# Altium schematic sheet ATmega324PB_Xplained_Pro_Target_MCU.SchDoc: Target MCU
size A3; Organization: ATMEL Norway; Address1: Vestre Rosten 79; Address2: N-7075 TILLER; Address3: NORWAY; DocumentNumber: A09-2589; Revision: 1; SheetNumber: 3; SheetTotal: 5; PageSetup: Record=PageOptions|CenterHorizontal=True|CenterVertical=True|PrintScale=1.01|XCorrection=1.00|YCorrection=1.00|PrintKind=1|BorderSize=5000000|LeftOffset=0|BottomOffset=0|Orientation=2|PaperLength=1000|PaperWidth=1000|Scale=100|PaperSource=7|PrintQuality=-4|MediaType=1|DitherType=10|PaperKind=A3 (297 x 420 mm)|PrintScaleMode=1
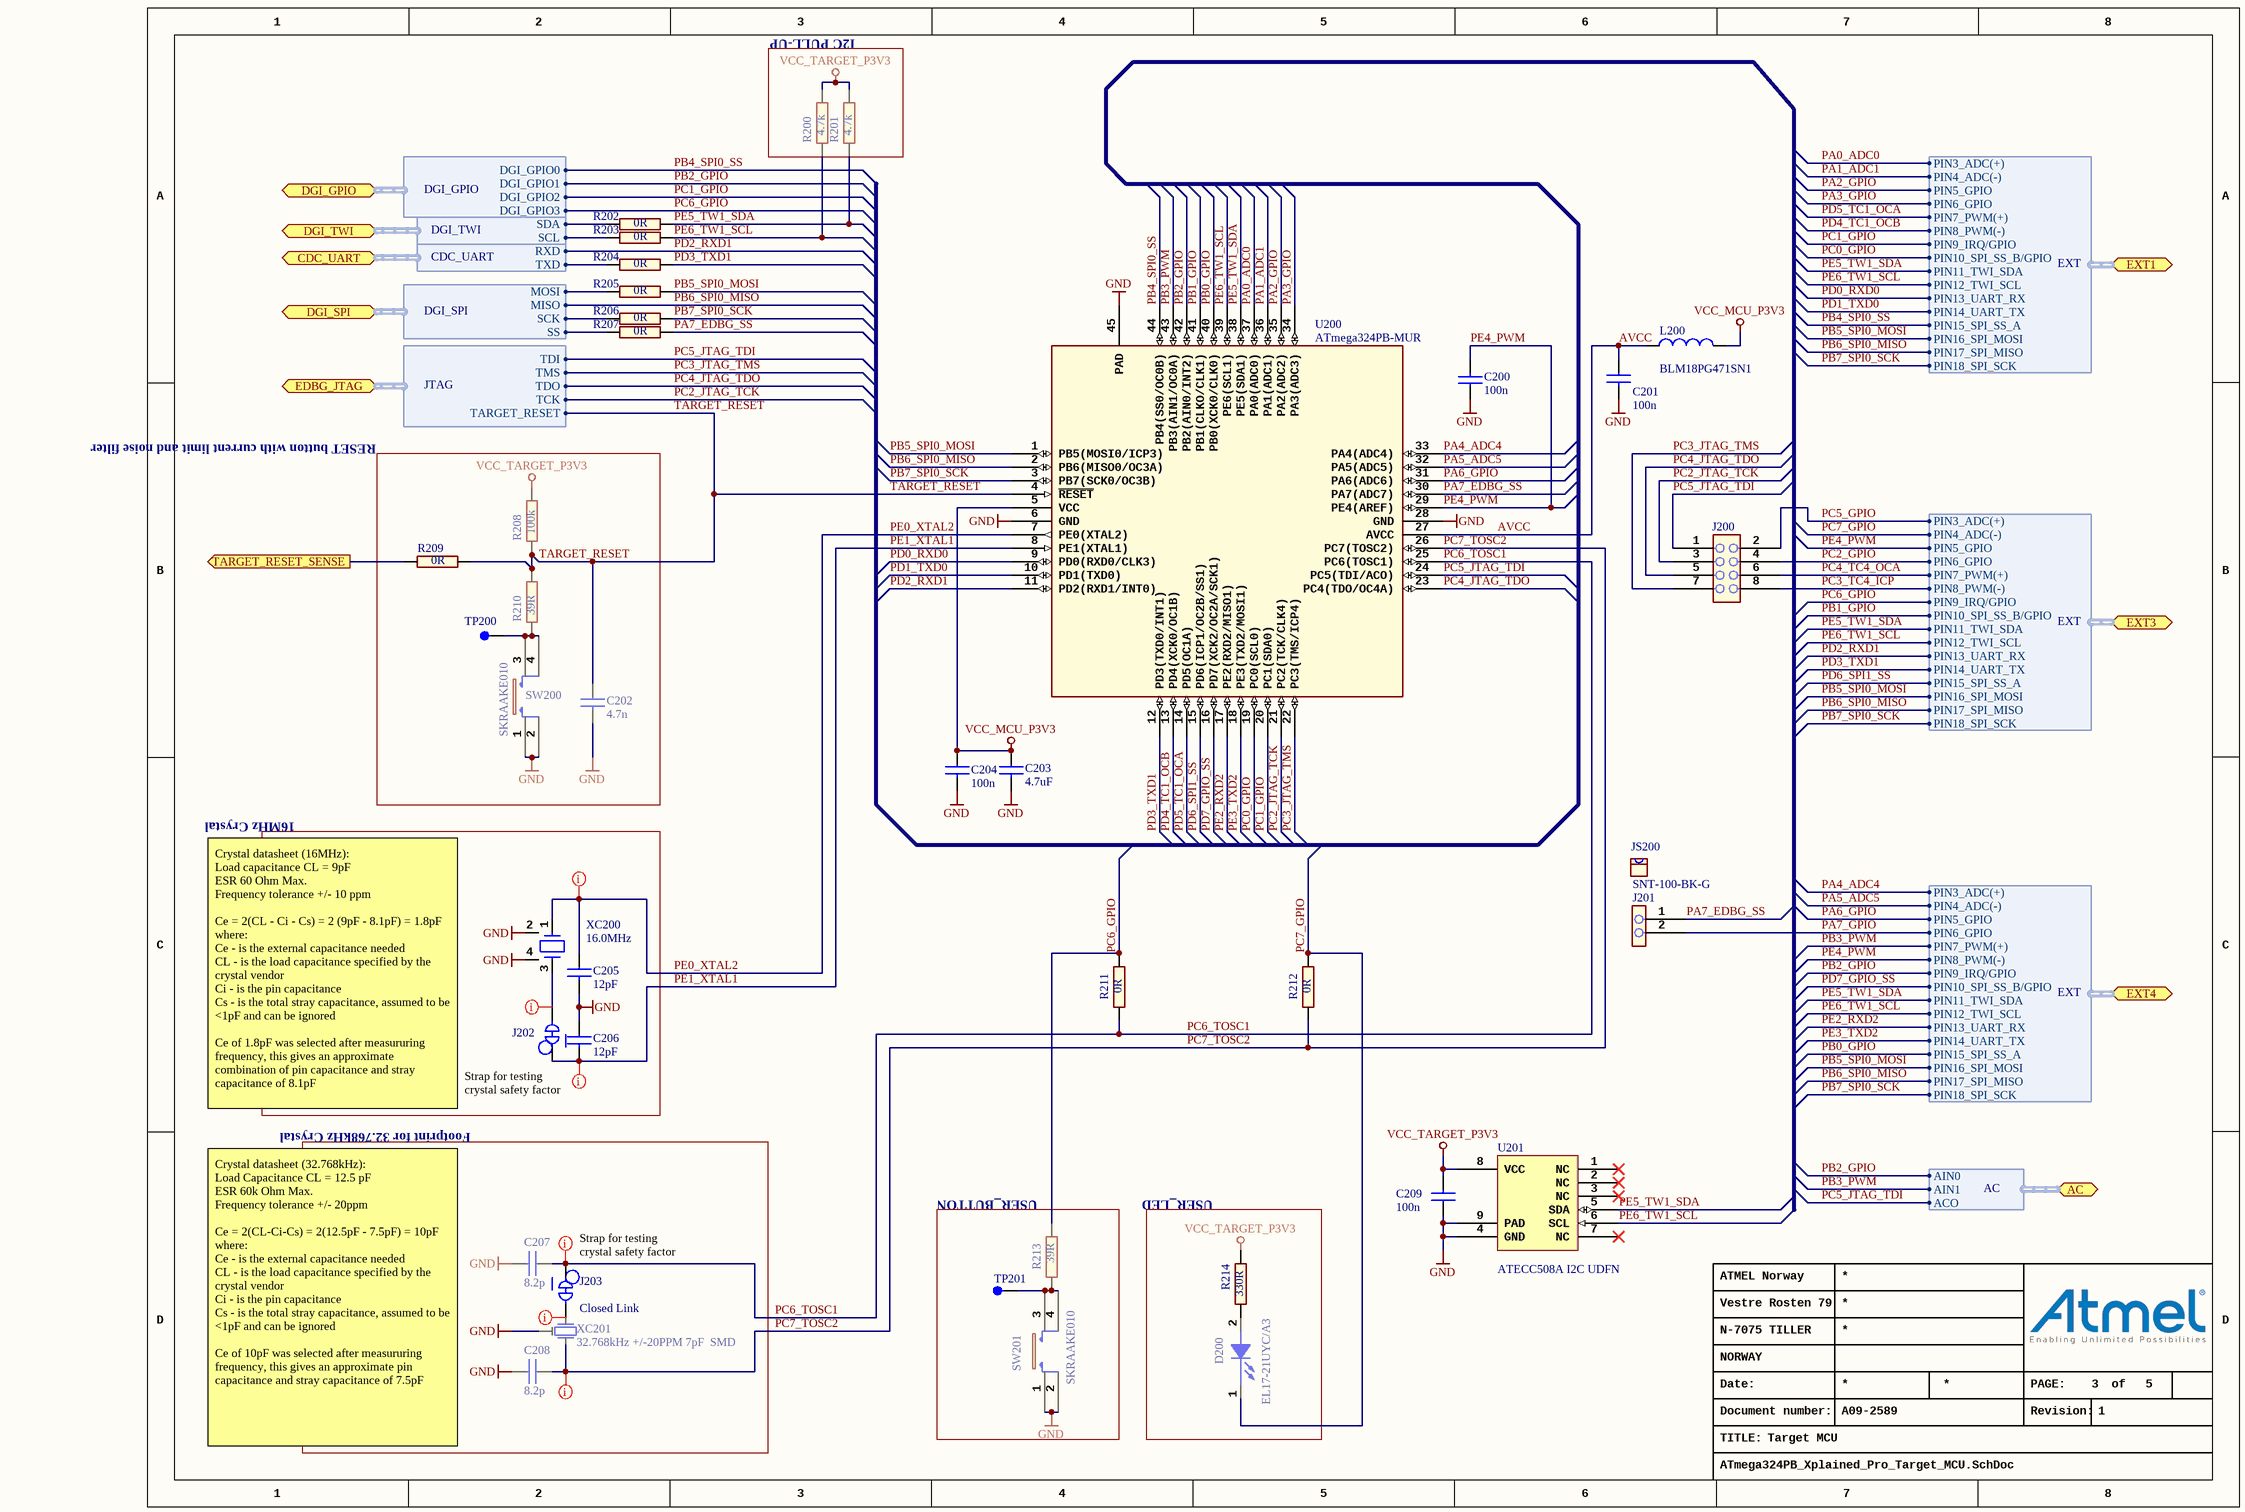
[diagram p0: ATmega324PB_Xplained_Pro_Target_MCU.SchDoc]

## Parts
C200  value 100n  [AP1-00001]
C201  value 100n  [AP1-00001]
C202  value 4.7n  [AP1-00053]
C203  value 4.7uF  [AP1-00039]
C204  value 100n  [AP1-00001]
C205  value 12pF  [AP1-00038]
C206  value 12pF  [AP1-00038]
C207  value 8.2p  [AP1-00001]
C208  value 8.2p  [AP1-00001]
C209  value 100n  [AP1-00001]
D200  value EL17-21UYC/A3  [AP4-00013]
J200  (no value)  [AP8-00971]
J201  (no value)  [AP8-00733]
J202  (no value)  [AP8-00595]  (net tie, no BOM)
J203  value Closed Link  [AP8-00595]  (net tie, no BOM)
JS200  value SNT-100-BK-G  [AP8-00525]
L200  value BLM18PG471SN1  [AP3-00005]
R200  value 4.7k  [AP2-00000]
R201  value 4.7k  [AP2-00000]
R202  value 0R  [AP2-00000]
R203  value 0R  [AP2-00000]
R204  value 0R  [AP2-00000]
R205  value 0R  [AP2-00000]
R206  value 0R  [AP2-00000]
R207  value 0R  [AP2-00000]
R208  value 100k  [AP2-00011]
R209  value 0R  [AP2-00000]
R210  value 39R  [AP2-00011]
R211  value 0R  [AP2-00000]
R212  value 0R  [AP2-00000]
R213  value 39R  [AP2-00011]
R214  value 330R  [AP2-00000]
SW200  value SKRAAKE010  [AP8-00137]  (hidden comment: Can be ordered in low volumes from Mouser)
SW201  value SKRAAKE010  [AP8-00137]  (hidden comment: Can be ordered in low volumes from Mouser)
TP200  (no value)  [AP8-00010]  (no BOM)
TP201  (no value)  [AP8-00010]  (no BOM)
U200  value ATmega324PB-MUR  [AP6-00147]  (hidden comment: Footprint has tight silkscreen to solder mask expansion clearance)
U201  value ATECC508A I2C UDFN  [AP6-00409]
XC200  value 16.0MHz  [AP7-00061]
XC201  value 32.768kHz +/-20PPM 7pF  SMD  [AP7-00044]  (hidden comment: Farnell order no:1539364)

## Blocks framed on the sheet
I2C PULL-UP: R200 R201
RESET button with current limit and noise filter: C202 R208-R210 SW200 TP200
16MHz Crystal: C205 C206 J202 XC200
Footprint for 32.768kHz Crystal: C207 C208 J203 XC201
USER_BUTTON: R213 SW201 TP201
USER_LED: D200 R214

## Ports
AC (harness AC), CDC_UART (harness CDC_UART), DGI_GPIO (harness DGI_GPIO), DGI_SPI (harness DGI_SPI), DGI_TWI (harness DGI_TWI), EDBG_JTAG (harness JTAG), EXT1 (harness EXT), EXT3 (harness EXT), EXT4 (harness EXT), TARGET_RESET_SENSE (out)

## Harnesses
DGI_GPIO: DGI_GPIO0, DGI_GPIO1, DGI_GPIO2, DGI_GPIO3
DGI_SPI: MISO, MOSI, SCK, SS
DGI_TWI: SCL, SDA
CDC_UART: RXD, TXD
EXT: PIN10_SPI_SS_B/GPIO, PIN11_TWI_SDA, PIN12_TWI_SCL, PIN13_UART_RX, PIN14_UART_TX, PIN15_SPI_SS_A, PIN16_SPI_MOSI, PIN17_SPI_MISO, PIN18_SPI_SCK, PIN3_ADC(+), PIN4_ADC(-), PIN5_GPIO, PIN6_GPIO, PIN7_PWM(+), PIN8_PWM(-), PIN9_IRQ/GPIO
JTAG: TCK, TDI, TDO, TMS, TARGET_RESET
AC: AIN1, AIN0, ACO

## Nets
GND: C200.1 C201.2 C202.2 C203.2 C204.2 C205.2 C206.1 C207.2 C208.2 C209.1 SW200.1 SW200.2 SW201.1 SW201.2 U200.6(GND) U200.28(GND) U200.45(PAD) U201.4(GND) U201.9(PAD) XC200.2(GND) XC200.4(GND) XC201.3
VCC_MCU_P3V3: C203.1 C204.1 L200.2 U200.5(VCC)
VCC_TARGET_P3V3: C209.2 R200.2 R201.2 R208.2 R214.2 U201.8(VCC)
AVCC: C201.1 L200.1 U200.27(AVCC)
PA0_ADC0: U200.37(PA0(ADC0)) ; port EXT1.PIN3_ADC(+)
PA1_ADC1: U200.36(PA1(ADC1)) ; port EXT1.PIN4_ADC(-)
PA2_GPIO: U200.35(PA2(ADC2)) ; port EXT1.PIN5_GPIO
PA3_GPIO: U200.34(PA3(ADC3)) ; port EXT1.PIN6_GPIO
PA4_ADC4: U200.33(PA4(ADC4)) ; port EXT4.PIN3_ADC(+)
PA5_ADC5: U200.32(PA5(ADC5)) ; port EXT4.PIN4_ADC(-)
PA6_GPIO: U200.31(PA6(ADC6)) ; port EXT4.PIN5_GPIO
PA7_EDBG_SS: J201.1 R207.2 U200.30(PA7(ADC7))
PA7_GPIO: J201.2 ; port EXT4.PIN6_GPIO
PB0_GPIO: U200.40(PB0(XCK0/CLK0)) ; port EXT4.PIN15_SPI_SS_A
PB1_GPIO: U200.41(PB1(CLKO/CLK1)) ; port EXT3.PIN10_SPI_SS_B/GPIO
PB2_GPIO: U200.42(PB2(AIN0/INT2)) ; port DGI_GPIO.DGI_GPIO1, port EXT4.PIN9_IRQ/GPIO, port AC.AIN0
PB3_PWM: U200.43(PB3(AIN1/OC0A)) ; port EXT4.PIN7_PWM(+), port AC.AIN1
PB4_SPI0_SS: U200.44(PB4(SS0/OC0B)) ; port DGI_GPIO.DGI_GPIO0, port EXT1.PIN15_SPI_SS_A
PB5_SPI0_MOSI: R205.2 U200.1(PB5(MOSI0/ICP3)) ; port EXT1.PIN16_SPI_MOSI, port EXT4.PIN16_SPI_MOSI, port EXT3.PIN16_SPI_MOSI
PB6_SPI0_MISO: U200.2(PB6(MISO0/OC3A)) ; port DGI_SPI.MISO, port EXT1.PIN17_SPI_MISO, port EXT4.PIN17_SPI_MISO, port EXT3.PIN17_SPI_MISO
PB7_SPI0_SCK: R206.2 U200.3(PB7(SCK0/OC3B)) ; port EXT1.PIN18_SPI_SCK, port EXT4.PIN18_SPI_SCK, port EXT3.PIN18_SPI_SCK
PC0_GPIO: U200.19(PC0(SCL0)) ; port EXT1.PIN10_SPI_SS_B/GPIO
PC1_GPIO: U200.20(PC1(SDA0)) ; port DGI_GPIO.DGI_GPIO2, port EXT1.PIN9_IRQ/GPIO
PC2_GPIO: J200.4 ; port EXT3.PIN6_GPIO
PC2_JTAG_TCK: J200.3 U200.21(PC2(TCK/CLK4)) ; port EDBG_JTAG.TCK
PC3_JTAG_TMS: J200.7 U200.22(PC3(TMS/ICP4)) ; port EDBG_JTAG.TMS
PC3_TC4_ICP: J200.8 ; port EXT3.PIN8_PWM(-)
PC4_JTAG_TDO: J200.5 U200.23(PC4(TDO/OC4A)) ; port EDBG_JTAG.TDO
PC4_TC4_OCA: J200.6 ; port EXT3.PIN7_PWM(+)
PC5_GPIO: J200.2 ; port EXT3.PIN3_ADC(+)
PC5_JTAG_TDI: J200.1 U200.24(PC5(TDI/ACO)) ; port EDBG_JTAG.TDI, port AC.ACO
PC6_GPIO: R211.2 R213.2 ; port DGI_GPIO.DGI_GPIO3, port EXT3.PIN9_IRQ/GPIO
PC6_TOSC1: C207.1 J203.1 R211.1 U200.25(PC6(TOSC1))
PC7_GPIO: D200.1(CATHODE) R212.2 ; port EXT3.PIN4_ADC(-)
PC7_TOSC2: C208.1 R212.1 U200.26(PC7(TOSC2)) XC201.1
PD0_RXD0: U200.9(PD0(RXD0/CLK3)) ; port EXT1.PIN13_UART_RX
PD1_TXD0: U200.10(PD1(TXD0)) ; port EXT1.PIN14_UART_TX
PD2_RXD1: U200.11(PD2(RXD1/INT0)) ; port CDC_UART.RXD, port EXT3.PIN13_UART_RX
PD3_TXD1: R204.2 U200.12(PD3(TXD0/INT1)) ; port EXT3.PIN14_UART_TX
PD4_TC1_OCB: U200.13(PD4(XCK0/OC1B)) ; port EXT1.PIN8_PWM(-)
PD5_TC1_OCA: U200.14(PD5(OC1A)) ; port EXT1.PIN7_PWM(+)
PD6_SPI1_SS: U200.15(PD6(ICP1/OC2B/SS1)) ; port EXT3.PIN15_SPI_SS_A
PD7_GPIO_SS: U200.16(PD7(XCK2/OC2A/SCK1)) ; port EXT4.PIN10_SPI_SS_B/GPIO
PE0_XTAL2: C205.1 U200.7(PE0(XTAL2)) XC200.1(IN)
PE1_XTAL1: C206.2 J202.1 U200.8(PE1(XTAL1))
PE2_RXD2: U200.17(PE2(RXD2/MISO1)) ; port EXT4.PIN13_UART_RX
PE3_TXD2: U200.18(PE3(TXD2/MOSI1)) ; port EXT4.PIN14_UART_TX
PE4_PWM: C200.2 U200.29(PE4(AREF)) ; port EXT4.PIN8_PWM(-), port EXT3.PIN5_GPIO
PE5_TW1_SDA: R201.1 R202.2 U200.38(PE5(SDA1)) U201.5(SDA) ; port EXT1.PIN11_TWI_SDA, port EXT4.PIN11_TWI_SDA, port EXT3.PIN11_TWI_SDA
PE6_TW1_SCL: R200.1 R203.2 U200.39(PE6(SCL1)) U201.6(SCL) ; port EXT1.PIN12_TWI_SCL, port EXT4.PIN12_TWI_SCL, port EXT3.PIN12_TWI_SCL
TARGET_RESET: C202.1 R208.1 R209.2 R210.2 U200.4(~{RESET}) ; port EDBG_JTAG.TARGET_RESET
TARGET_RESET_SENSE: R209.1 ; port TARGET_RESET_SENSE
NetD200_2: D200.2(ANODE) R214.1
NetJ202_2: J202.2 XC200.3(OUT)
NetJ203_2: J203.2 XC201.2
NetR202_1: R202.1 ; port DGI_TWI.SDA
NetR203_1: R203.1 ; port DGI_TWI.SCL
NetR204_1: R204.1 ; port CDC_UART.TXD
NetR205_1: R205.1 ; port DGI_SPI.MOSI
NetR206_1: R206.1 ; port DGI_SPI.SCK
NetR207_1: R207.1 ; port DGI_SPI.SS
NetR210_1: R210.1 SW200.3 SW200.4 TP200.1
NetR213_1: R213.1 SW201.3 SW201.4 TP201.1

Not connected (* = marked no-connect by the designer): U201 1(NC)* 2(NC)* 3(NC)* 7(NC)*

## Layout directives
rule Assembly Testpoint Usage [Testpoint - Not Allowed    Multiple - Not Allowed]: NetJ202_2, NetJ203_2, PC6_TOSC1, PC7_TOSC2, PE0_XTAL2, PE1_XTAL1

## Notes on the sheet
- Crystal datasheet (16MHz):
  Load capacitance CL = 9pF
  ESR 60 Ohm Max.
  Frequency tolerance +/- 10 ppm
  Ce = 2(CL - Ci - Cs) = 2 (9pF - 8.1pF) = 1.8pF
  where:
  Ce - is the external capacitance needed
  CL - is the load capacitance specified by the crystal vendor
  Ci - is the pin capacitance
  Cs - is the total stray capacitance, assumed to be <1pF and can be ignored
  Ce of 1.8pF was selected after measururing frequency, this gives an approximate combination of pin capacitance and stray capacitance of 8.1pF
- Strap for testing crystal safety factor
- (near J203) Strap for testing crystal safety factor
- Crystal datasheet (32.768kHz):
  Load Capacitance CL = 12.5 pF
  ESR 60k Ohm Max.
  Frequency tolerance +/- 20ppm
  Ce = 2(CL-Ci-Cs) = 2(12.5pF - 7.5pF) = 10pF
  where:
  Ce - is the external capacitance needed
  CL - is the load capacitance specified by the crystal vendor
  Ci - is the pin capacitance
  Cs - is the total stray capacitance, assumed to be <1pF and can be ignored
  Ce of 10pF was selected after measururing frequency, this gives an approximate pin capacitance and stray capacitance of 7.5pF
- Date:
- PAGE:
- of
- TITLE:
- Document number:
- Revision:

## Library data of the parts
C200 C201 C204 C209 = A01-0246: Ceramic capacitor, SMD 0402, X7R, 16V, +/-10%; PartGroup: Capacitors,Ceramic,SMD 0402; Manufacturer: Kemet; MPN: C0402C104K4RACTU; TemperatureRange: -55 - +125 deg C; AN: A01-0246; Tolerance: 16V, +/-10%; Height: 0,5
C202 = A01-0046: Ceramic capacitor, SMD 0402, X7R, 25V, +/-10% (de35287); PartGroup: Capacitors,Ceramic,SMD 0402; TemperatureRange: -55 - +125 deg C; AN: A01-0046; Height: 0,550000011920929; Tolerance: 25V, +/-10%
C203 = A01-0377: Ceramic capacitor, SMD 0603, X5R, 10V, 10% (de31036); PartGroup: Capacitors,Ceramic,SMD 0603; Manufacturer: tdk; MPN: C1608X5R1A475K; TemperatureRange: -55 - +85 deg C; AN: A01-0377; Tolerance: 10%; Height: 0,800000011920929
C205 C206 = A01-0355: Ceramic capacitor, SMD 0402, NP0, 50V, +/-5% (de19819); PartGroup: Capacitors,Ceramic,SMD 0402; Manufacturer: Kyocera-elco; MPN: CM05CG120J50AH; Tolerance: 5%; TemperatureRange: -55 - +125 deg C; AN: A01-0355
C207 C208 = A01-0014: Ceramic capacitor, SMD 0402, NP0, 50V, +/-5%; PartGroup: Capacitors,Ceramic,SMD 0402; TemperatureRange: -55 - +125 deg C; AN: A01-0014; Tolerance: 50V, +/-5%; Height: 0,550000011920929
D200 = A10-0019: LED, Yellow, Wave length=591nm, SMD 0805, ±70°; PartGroup: Opto,LEDs,SMD; Manufacturer: Everlight; MPN: 17-21UYC/S530-A3/TR8; TemperatureRange: -40 to +85 deg C; AN: A10-0019; Height: 1,10000002384186
J200 = A08-2452: 2x4 pin header, 2.54 mm pitch, Pin-in-Paste THM; PartGroup: Mechanical devices,Connectors,Pin headers; Manufacturer: SAMTEC; Value: HMTSW-104-23-F-D-237; TemperatureRange: - 55 C to + 125 C; AN: A08-2452; Height: 6,09999990463257; MPN: HMTSW-104-23-F-D-237
J201 = A08-1754: 1x2 pin header, 2.54mm pitch, Pin-in-Paste THM; PartGroup: Mechanical devices,Connectors,Pin headers; Manufacturer: SAMTEC; Value: HMTSW-102-23-F-S-237; TemperatureRange: - 55 deg C to + 125 deg C; AN: A08-1754; Height: 6,09999990463257; MPN: HMTSW-102-23-F-S-237
J202 J203 = A08-1454: Closed Link 0402; PartGroup: Mechanical devices,PCB implemented components; AN: A08-1454
  J202: Value: Closed Link
JS200 = A08-0543: Jumper cap for 2.54mm pinheader; PartGroup: Mechanical devices,Mounting accessories,Other; Manufacturer: SAMTEC; AN: A08-0543; MPN: SNT-100-BK-G
L200 = A03-0035: SMD RF inductor 0603. Z=470Ohm (@100MHz), Max R(dc)=0.65Ohm, Max current=1A; PartGroup: Inductors,EMI; Manufacturer: Murata; Tolerance: ±25%; TemperatureRange: -55°C to +125°C; AN: A03-0035; Height: 0,800000011920929; MPN: BLM18PG471SN1
R200 R201 = A02-0228: Thick film resistor, SMD 0402, 1/16W, 1%; PartGroup: Resistors,SMD,0402 1%; TemperatureRange: -55ï¿½ to +125ï¿½C; AN: A02-0228; Tolerance: 1 %; Height: 0,349999994039536
R202-R207 R209 R211 R212 = A02-0163: RES 0.0 OHM 1/16W 0402 SMD; PartGroup: Resistors,SMD,0402 1%; Manufacturer: (n/a); MPN: RMCF0402ZT0R00; Tolerance: 1 %; TemperatureRange: -55 - +125 deg C; AN: A02-0163; Height: 0,349999994039536
R208 = A02-0260: Thick film resistor, SMD 0402, 1/16W, 1%; PartGroup: Resistors,SMD,0402 1%; TemperatureRange: -55ï¿½ to +125ï¿½C; AN: A02-0260; Tolerance: 1 %; Height: 0,349999994039536
R210 R213 = A02-0178: Thick film resistor, SMD 0402, 1/16W, 1%; PartGroup: Resistors,SMD,0402 1%; TemperatureRange: -55 - +125 deg C; AN: A02-0178; Tolerance: 1 %; Height: 0,349999994039536
R214 = A02-0200: Thick film resistor, SMD 0402, 1/16W, 1%; PartGroup: Resistors,SMD,0402 1%; TemperatureRange: -55 - +125 deg C; AN: A02-0200; Tolerance: 1 %; Height: 0,349999994039536
SW200 SW201 = A08-0790: 6.2x6.2 mm SMD tact switch, same as A08-0091 but less force is needed; PartGroup: Mechanical devices,Switches,SMD; Manufacturer: ALPS; TemperatureRange: -30 - +90 deg C; AN: A08-0790; Height: 5,09999990463257; MPN: SKRAAKE010
TP200 TP201 = A08-0004: Single SMD testpad; PartGroup: Mechanical devices,Connectors,Test points; AN: A08-0004; Value: TESTPAD; Height: 0
U200 = A06-1345: AVR 8-bit RISC MCU; PartGroup: Integrated Circuits,MCU, MPU, DSP,AVR MCU; Manufacturer: ATMEL; AN: A06-1345; MPN: ATmega324PB-MUR
U201 = A06-1281: ATECC508A with an I2C Interface and a 8 Pin UDFN Package with Paddle; PartGroup: Integrated Circuits,Special function,Encryption; Manufacturer: ATMEL; MPN: ATECC508A-MAHDA-T; AN: A06-1281; Height: 0,600000023841858
XC200 = A07-0078: 16MHz uXtal, 3.2 x 2.5 mm SMD, CL=9pF, 15PPM, ESR=80ohm(Max.; PartGroup: Frequency devices,Crystals,SMD; Manufacturer: Epson Toyocom; MPN: TSX-3225 16.0000MF09Z-AC3; TemperatureRange: -40Â°C to +85Â°C; AN: A07-0078; Tolerance: 15ppm; Height: 0,699999988079071
XC201 = A07-0052: 32k768 crystal, +-20ppm, CL=7pF, max ESR 60kOhm, SMD; PartGroup: Frequency devices,Crystals,SMD; Manufacturer: Micro Crystal; MPN: MS1V-T1K 32.768kHz 7pF +/-20PPM TA; Tolerance: +/- 20 PPM; TemperatureRange: -40 /+85; AN: A07-0052; Height: 2,07999992370605